# Altium schematic sheet Safety.SchDoc
size A
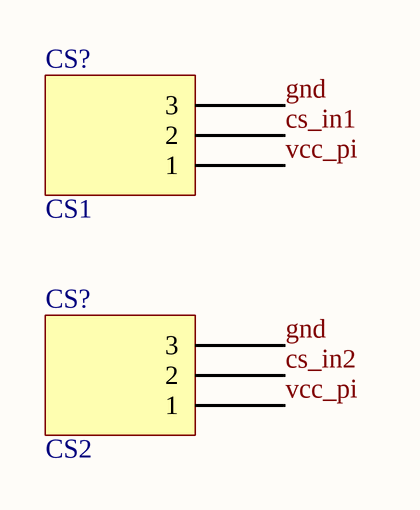
[diagram p0: Safety.SchDoc]

## Parts
(Parts that share a designator on the sheet are numbered #1, #2 ... from top to bottom, then left to right.)
CS?#1  CS1  [ACS712]
CS?#2  CS2  [ACS712]

## Nets
cs_in1: CS?#1.2
cs_in2: CS?#2.2
gnd: CS?#1.3 CS?#2.3
vcc_pi: CS?#1.1 CS?#2.1

## Library data of the parts
CS?#1 CS?#2 = ACS712